# Altium project HomeAutomation.PrjPcb
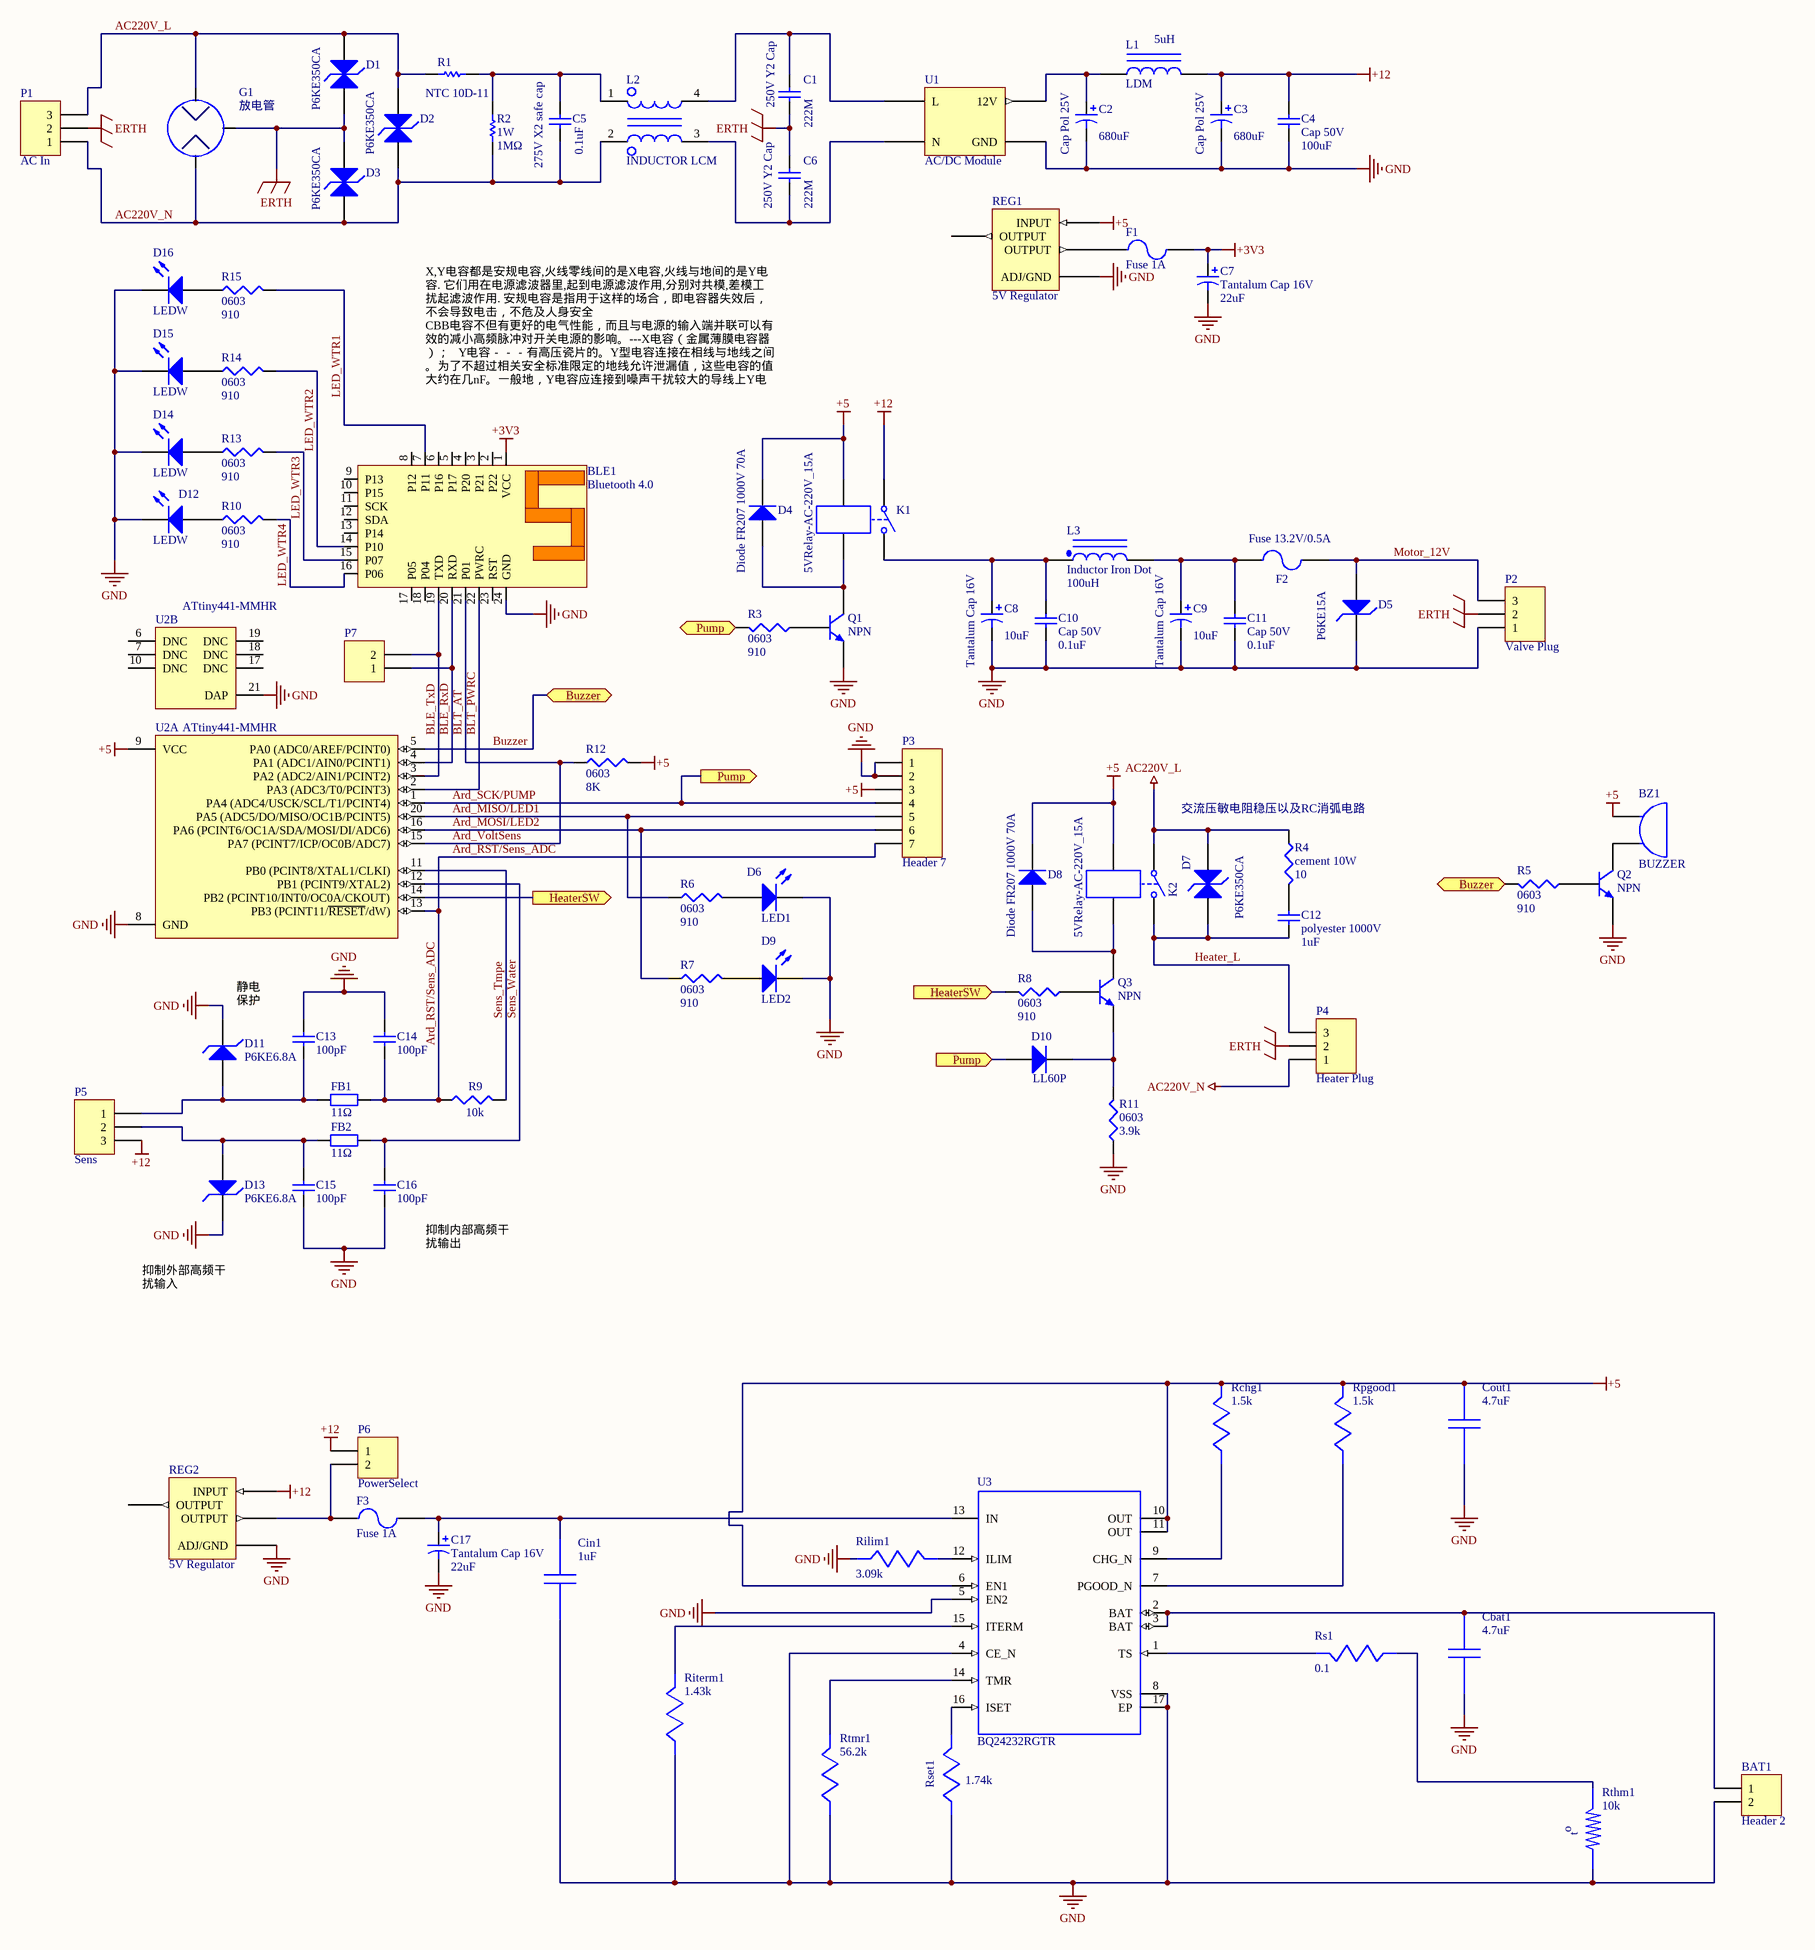
[diagram p0: Solar Water Heater Controller.SchDoc]
1 sheet, 88 parts. Net scope: flat (ports and power ports of the same name join across sheets).
Board file: Solar Water Heater Controller.PcbDoc

## Sheet Solar Water Heater Controller.SchDoc
size A2; PageSetup: Record=PageOptions|CenterHorizontal=True|CenterVertical=True|PrintScale=0.97|XCorrection=1.00|YCorrection=1.00|PrintKind=1|BorderSize=5000000|LeftOffset=0|BottomOffset=0|Orientation=2|PaperLength=1000|PaperWidth=1000|Scale=100|PaperSource=7|PrintQuality=-3|MediaType=1|DitherType=10|PrintScaleMode=1|PaperKind=A4 (210 x 297毫米)|PaperIndex=9

### Parts
BAT1  Header 2  [HDR1X2]
BLE1  Bluetooth 4.0  [JDY-08]
BZ1  BUZZER  [Buzzer]
C1  250V Y2 Cap  value 222M  [CapY2]
C2  Cap Pol 25V  value 680uF  [Cap680uf]
C3  Cap Pol 25V  value 680uF  [Cap680uf]
C4  Cap 50V  value 100uF  [1608[0603]]
C5  275V X2 safe cap  value 0.1uF  [CapX2]
C6  250V Y2 Cap  value 222M  [CapY2]
C7  Tantalum Cap 16V  value 22uF  [CAPC3216X175N]
C8  Tantalum Cap 16V  value 10uF  [CAPC3216X175N]
C9  Tantalum Cap 16V  value 10uF  [CAPC3216X175N]
C10  Cap 50V  value 0.1uF  [1608[0603]]
C11  Cap 50V  value 0.1uF  [1608[0603]]
C12  polyester 1000V  value 1uF  [CBB21 Capacitor]
C13  value 100pF  [1608[0603]]  (hidden comment: Cap Semi)
C14  value 100pF  [1608[0603]]  (hidden comment: Cap Semi)
C15  value 100pF  [1608[0603]]  (hidden comment: Cap Semi)
C16  value 100pF  [1608[0603]]  (hidden comment: Cap Semi)
C17  Tantalum Cap 16V  value 22uF  [CAPC3216X175N]
Cbat1  value 4.7uF  [1608[0603]]  (hidden comment: GRM219C81A475KE34D)
Cin1  value 1uF  [1608[0603]]  (hidden comment: GRM188R61A105KA61D)
Cout1  value 4.7uF  [1608[0603]]  (hidden comment: GRM21BR61E475MA12L)
D1  P6KE350CA  [DO-15]
D2  P6KE350CA  [DO-15]
D3  P6KE350CA  [DO-15]
D4  Diode FR207 1000V 70A  [DO-15]
D5  P6KE15A  [DO-15]
D6  LED1  [LED_1420]
D7  P6KE350CA  [DO-15]
D8  Diode FR207 1000V 70A  [DO-15]
D9  LED2  [LED_1420]
D10  LL60P  [LL60P]
D11  P6KE6.8A  [ONSC-SMB-2-403A-03_H_V]
D12  LEDW  [LED_1420]
D13  P6KE6.8A  [ONSC-SMB-2-403A-03_H_V]
D14  LEDW  [LED_1420]
D15  LEDW  [LED_1420]
D16  LEDW  [LED_1420]
F1  Fuse 1A  [6-0805_L]
F2  Fuse 13.2V/0.5A  [CAPC3216X100N]
F3  Fuse 1A  [6-0805_L]
FB1  value 11Ω  [6-0805_L]  (hidden comment: FB)
FB2  value 11Ω  [6-0805_L]  (hidden comment: FB)
G1  放电管  [GAS TUBE]
K1  5VRelay-AC-220V_15A  [SZ-S105LM]
K2  5VRelay-AC-220V_15A  [SZ-S105LM]
L1  LDM  value 5uH  [CD54]
L2  INDUCTOR LCM  [sumida CPFC1709/MS]
L3  Inductor Iron Dot  value 100uH  [CD54]
P1  AC In  [3P 5.08mm Connecter]
P2  Valve Plug  [3P 5.08mm Connecter]
P3  Header 7  [HDR1X7]
P4  Heater Plug  [3P 5.08mm Connecter]
P5  Sens  [3P 5.08mm Connecter]
P6  PowerSelect  [J1-0603]
P7  Serial  [HDR1X2]  (value not drawn)
Q1  NPN  [SOT23-3]
Q2  NPN  [SOT23-3]
Q3  NPN  [SOT23-3]
R1  NTC 10D-11  [NTC 10D-11]
R2  1W  value 1MΩ  [AXIAL-0.5]
R3  0603  value 910  [J1-0603]
R4  cement 10W  value 10  [5W Resistor]
R5  0603  value 910  [J1-0603]
R6  0603  value 910  [J1-0603]
R7  0603  value 910  [J1-0603]
R8  0603  value 910  [J1-0603]
R9  value 10k  [J1-0603]  (hidden comment: 0603)
R10  0603  value 910  [J1-0603]
R11  0603  value 3.9k  [J1-0603]
R12  0603  value 8K  [J1-0603]
R13  0603  value 910  [J1-0603]
R14  0603  value 910  [J1-0603]
R15  0603  value 910  [J1-0603]
Rchg1  value 1.5k  [J1-0603]  (hidden comment: CRCW04021K50FKED)
REG1  5V Regulator  [SOT223]
REG2  5V Regulator  [SOT223]
Rilim1  value 3.09k  [J1-0603]  (hidden comment: CRCW04023K09FKED)
Riterm1  value 1.43k  [J1-0603]  (hidden comment: CRCW04021K43FKED)
Rpgood1  value 1.5k  [J1-0603]  (hidden comment: CRCW04021K50FKED)
Rs1  value 0.1  [J1-0603]  (hidden comment: ERJ-2BSFR10X)
Rset1  value 1.74k  [J1-0603]  (hidden comment: CRCW04021K74FKED)
Rthm1  value 10k  [J1-0603]  (hidden comment: NCP15XH103E03RC)
Rtmr1  value 56.2k  [J1-0603]  (hidden comment: CRCW040256K2FKED)
U1  AC/DC Module  [HB12N10-2836]
U2  ATtiny441-MMHR  [20M2_N]  (parts A,B of 2)
U3  BQ24232RGTR  [RGT16-1700X1700TP]

### Ports
Buzzer (bidir), HeaterSW (in), HeaterSW (out), Pump, Pump (in), Pump (out)

### Nets
+3V3: BLE1.1(VCC) C7.1 F1.2
+5: BZ1.1(A) Cout1.1 D4.2(K) D8.2(K) K1.3 K2.3 P3.3 R12.2 Rchg1.1 REG1.3(INPUT) Rpgood1.1 U2.9(VCC) U3.6(EN1) U3.10(OUT) U3.11(OUT)
+12: C3.1 C4.2 K1.1 L1.2 P5.3 P6.1 REG2.3(INPUT)
AC220V_L: D1.2(K) D2.2(K) D7.2(K) G1.1 K2.1 P1.3 R1.2 R4.1
AC220V_N: C5.2 D2.1(A) D3.1(A) G1.3 L2.2 P1.1 P4.1 R2.1
ERTH: C1.1 C6.2 D1.1(A) D3.2(K) G1.2 P1.2 P2.2 P4.2
GND: BAT1.2 BLE1.24(GND) C2.2 C3.2 C4.1 C7.2 C8.2 C9.2 C10.1 C11.1 C13.2 C14.2 C15.2 C16.2 C17.2 Cbat1.2 Cin1.2 Cout1.2 D5.2(K) D6.2(K) D9.2(K) D11.2(K) D12.2(K) D13.2(K) D14.2(K) D15.2(K) D16.2(K) P2.1 P3.1 P3.2 Q1.3(E) Q2.3(E) R11.1 REG1.1(ADJ/GND) REG2.1(ADJ/GND) Rilim1.2 Riterm1.2 Rset1.2 Rthm1.1 Rtmr1.2 U1.5(GND) U2.8(GND) U2.21(DAP) U3.4(CE_N) U3.5(EN2) U3.8(VSS) U3.17(EP)
Ard_MISO/LED1: P3.5 R6.1 U2.20(PA5_(ADC5/DO/MISO/OC1B/PCINT5))
Ard_MOSI/LED2: P3.6 R7.1 U2.16(PA6_(PCINT6/OC1A/SDA/MOSI/DI/ADC6))
Ard_RST/Sens_ADC: C14.1 FB1.2 P3.7 R9.2 U2.13(PB3_(PCINT11/~{RESET}/dW))
Ard_SCK/PUMP: D10.1(A) P3.4 R3.2 U2.1(PA4_(ADC4/USCK/SCL/T1/PCINT4)) ; port Pump
Ard_VoltSens: BLE1.21(P01) R12.1 U2.15(PA7_(PCINT7/ICP/OC0B/ADC7))  [also labelled BLT_AT]
BLE_RxD: BLE1.20(RXD) P7.1 U2.4(PA1_(ADC1/AIN0/PCINT1))
BLE_TxD: BLE1.19(TXD) P7.2 U2.3(PA2_(ADC2/AIN1/PCINT2))
BLT_PWRC: BLE1.22(PWRC) U2.2(PA3_(ADC3/T0/PCINT3))
Buzzer: R5.2 U2.5(PA0_(ADC0/AREF/PCINT0)) ; port Buzzer
Heater_L: C12.2 D7.1(A) K2.2 P4.3
LED_WTR1: BLE1.7(P11) R15.1
LED_WTR2: BLE1.14(P10) R14.1
LED_WTR3: BLE1.15(P07) R13.1
LED_WTR4: BLE1.16(P06) R10.1
Motor_12V: D5.1(A) F2.1 P2.3
Sens_Tmpe: R9.1 U2.11(PB0_(PCINT8/XTAL1/CLKI))
Sens_Water: C16.1 FB2.2 U2.12(PB1_(PCINT9/XTAL2))
NetBAT1_1: BAT1.1 Cbat1.1 U3.2(BAT) U3.3(BAT)
NetBZ1_2: BZ1.2(B) Q2.1(C)
NetC1_2: C1.2 L2.4 U1.1(L)
NetC2_1: C2.1 L1.1 U1.3(12V)
NetC5_1: C5.1 L2.1 R1.1 R2.2
NetC6_1: C6.1 L2.3 U1.2(N)
NetC8_1: C8.1 C10.2 K1.2 L3.1
NetC9_1: C9.1 C11.2 F2.2 L3.2
NetC12_1: C12.1 R4.2
NetC13_1: C13.1 D11.1(A) FB1.1 P5.1
NetC15_1: C15.1 D13.1(A) FB2.1 P5.2
NetC17_1: C17.1 Cin1.1 F3.2 U3.13(IN)
NetD4_1: D4.1(A) K1.4 Q1.1(C)
NetD6_1: D6.1(A) R6.2
NetD8_1: D8.1(A) K2.4 Q3.1(C)
NetD9_1: D9.1(A) R7.2
NetD10_2: D10.2(K) Q3.3(E) R11.2
NetD12_1: D12.1(A) R10.2
NetD14_1: D14.1(A) R13.2
NetD15_1: D15.1(A) R14.2
NetD16_1: D16.1(A) R15.2
NetF1_1: F1.1 REG1.2(OUTPUT)
NetF3_1: F3.1 P6.2 REG2.2(OUTPUT)
NetQ1_2: Q1.2(B) R3.1
NetQ2_2: Q2.2(B) R5.1
NetQ3_2: Q3.2(B) R8.1
NetR8_2: R8.2 U2.14(PB2_(PCINT10/INT0/OC0A/CKOUT)) ; port HeaterSW
NetRchg1_2: Rchg1.2 U3.9(CHG_N)
NetRilim1_1: Rilim1.1 U3.12(ILIM)
NetRiterm1_1: Riterm1.1 U3.15(ITERM)
NetRpgood1_2: Rpgood1.2 U3.7(PGOOD_N)
NetRs1_1: Rs1.1 U3.1(TS)
NetRs1_2: Rs1.2 Rthm1.2
NetRset1_1: Rset1.1 U3.16(ISET)
NetRtmr1_1: Rtmr1.1 U3.14(TMR)

Not connected (* = marked no-connect by the designer): BLE1 2(P22) 3(P21) 4(P20) 5(P17) 6(P16) 8(P12) 9(P13) 10(P15) 11(SCK) 12(SDA) 13(P14) 17(P05) 18(P04) 23(RST); REG1 4(OUTPUT); REG2 4(OUTPUT); U2 6(DNC) 7(DNC) 10(DNC) 17(DNC) 18(DNC) 19(DNC)

### Notes on the sheet
- X,Y电容都是安规电容,火线零线间的是X电容,火线与地间的是Y电容. 它们用在电源滤波器里,起到电源滤波作用,分别对共模,差模工扰起滤波作用. 安规电容是指用于这样的场合，即电容器失效后，不会导致电击，不危及人身安全
  CBB电容不但有更好的电气性能，而且与电源的输入端并联可以有效的减小高频脉冲对开关电源的影响。---X电容（金属薄膜电容器）；   Y电容－－－有高压瓷片的。Y型电容连接在相线与地线之间。为了不超过相关安全标准限定的地线允许泄漏值，这些电容的值大约在几nF。一般地，Y电容应连接到噪声干扰较大的导线上Y电容分为Y1电容和Y2电容，Y1属于双绝缘Y电容,用于跨接一二次侧.Y2则属于基本单绝缘Y电容,用于跨接一次侧对保护大地即FG线根据IEC 60384-14，电容器分为X电容及Y电容， 1. X电容是指跨于L-N之间的电容器， 2. Y电容是指跨于L-G/N-G之间的电容器。 (L="Line", N="Neutral", G="Ground")
- (near R4) 交流压敏电阻稳压以及RC消弧电路
- 静电
  保护
- 抑制外部高频干扰输入
- (near C16) 抑制内部高频干扰输出
- (near Rthm1) o
- (near Rthm1) t

### Library data of the parts
BAT1 P6 P7 = Header 2: Header, 2-Pin; LatestRevisionDate: 17-Jul-2002; LatestRevisionNote: Re-released for DXP Platform.; Publisher: Altium Limited
BLE1 = CC2541-Small
BZ1 = BUZZER: 5V有源蜂鸣器 电磁式 SOT塑封管 5V 12mm
C1 C6 = Cap Semi: JNC222M 250V; Published: 8-Jun-2000; LatestRevisionDate: 29-May-2009; LatestRevisionNote: IPC-7351 Footprint Added.; PackageReference: C1206; Publisher: Altium Limited; PackageDescription: Chip Capacitor
C2 C3 = Cap Pol1: Polarized Capacitor (Radial); Published: 8-Jun-2000; LatestRevisionDate: 17-Jul-2002; LatestRevisionNote: Re-released for DXP Platform.; PackageReference: RB7.6-15; Publisher: Altium Limited; PackageDescription: Polarized Capacitor (Radial); 2 Leads
C4 C10-C16 = Cap Semi: Capacitor (Semiconductor SIM Model); Published: 8-Jun-2000; LatestRevisionDate: 29-May-2009; LatestRevisionNote: IPC-7351 Footprint Added.; PackageReference: C1206; Publisher: Altium Limited; PackageDescription: Chip Capacitor
C5 = Cap Semi: MPX104KV 275V X2安规电容; Published: 8-Jun-2000; LatestRevisionDate: 29-May-2009; LatestRevisionNote: IPC-7351 Footprint Added.; PackageReference: C1206; Publisher: Altium Limited; PackageDescription: Chip Capacitor
C7 C17 = Cap Pol3: 22UF 16V 226K A3216 1206; Published: 8-Jun-2000; LatestRevisionDate: 29-May-2009; LatestRevisionNote: IPC-7351 Footprint Added.; PackageReference: C0805; Publisher: Altium Limited; PackageDescription: Chip Capacitor
C8 C9 = Cap Pol3: Published: 8-Jun-2000; LatestRevisionDate: 29-May-2009; LatestRevisionNote: IPC-7351 Footprint Added.; PackageReference: C0805; Publisher: Altium Limited; PackageDescription: Chip Capacitor
Cbat1 = GRM219C81A475KE34D: GRM219C81A475KE3; Manufacturer Name: MuRata; PackageReference: GRM219C81A475KE34D; Manufacturer Part Number: GRM219C81A475KE34D
Cin1 = GRM188R61A105KA61D: GRM188R61A105KA6; Manufacturer Name: MuRata; PackageReference: GRM188R61A105KA61D; Manufacturer Part Number: GRM188R61A105KA61D
Cout1 = GRM21BR61E475MA12L: GRM21BR61E475MA1; Manufacturer Name: MuRata; PackageReference: GRM21BR61E475MA12L; Manufacturer Part Number: GRM21BR61E475MA12L
D1-D3 D7 = Diode TVS
D4 D8 = Diode 1N914: High Conductance Fast Diode; Published: 8-Jun-2000; LatestRevisionDate: 17-Jul-2002; LatestRevisionNote: Re-released for DXP Platform.; DatasheetVersion: 1997; PackageReference: DO-35; Publisher: Altium Limited; PackageDescription: Diode, Axial; Body 3.8 x 1.9 mm (LxDia. max), Lead Dia. 0.53 mm (max); Code_JEDEC: DO-204-AH; ComponentLink1Description: Manufacturer Link; ComponentLink1URL: http://www.fairchildsemi.com/; ComponentLink2Description: Datasheet; ComponentLink2URL: http://www.fairchildsemi.com/ds/1N%2F1N4448.pdf
D5 D11 = Diode TVS_S
D6 D9 D12 D14-D16 = LED2: Typical RED, GREEN, YELLOW, AMBER GaAs LED; Published: 8-Jun-2000; LatestRevisionDate: 17-Jul-2002; LatestRevisionNote: Re-released for DXP Platform.; PackageVersion: Feb-2002; PackageReference: 3.2X1.6X1.1; Publisher: Altium Limited; PackageDescription: SM LED; 2 Flat Leads
D10 = Diode 1N914: Published: 8-Jun-2000; LatestRevisionDate: 17-Jul-2002; LatestRevisionNote: Re-released for DXP Platform.; DatasheetVersion: 1997; PackageReference: DO-35; Publisher: Altium Limited; PackageDescription: Diode, Axial; Body 3.8 x 1.9 mm (LxDia. max), Lead Dia. 0.53 mm (max); Code_JEDEC: DO-204-AH; ComponentLink1Description: Manufacturer Link; ComponentLink1URL: http://www.fairchildsemi.com/; ComponentLink2Description: Datasheet; ComponentLink2URL: http://www.fairchildsemi.com/ds/1N%2F1N4448.pdf
D13 = Diode TVS_S: P6KE6.8A SMB
F1 F3 = Fuse 2: Fuse 1000mA 6V; Published: 8-Jun-2000; LatestRevisionDate: 17-Jul-2002; LatestRevisionNote: Re-released for DXP Platform.; PackageReference: PIN-W2/E2.8; Publisher: Altium Limited; PackageDescription: Thru-Hole; 2 Leads
F2 = Fuse 2: 1206SMD 500mA 13.2V/0.5A; Published: 8-Jun-2000; LatestRevisionDate: 17-Jul-2002; LatestRevisionNote: Re-released for DXP Platform.; PackageReference: PIN-W2/E2.8; Publisher: Altium Limited; PackageDescription: Thru-Hole; 2 Leads
FB1 FB2 = Res2: 磁珠; Published: 8-Jun-2000; LatestRevisionDate: 17-Jul-2002; LatestRevisionNote: Re-released for DXP Platform.; PackageReference: AXIAL-0.4; Publisher: Altium Limited; PackageDescription: Axial Device, Thru-Hole; 2 Leads; 0.4 in Pin Spacing
G1 = GOT: 3RM230L-8 230V
K1 K2 = Relay-SPST: Single-Pole Single-Throw Relay SZ-S-105LM; Published: 24-Mar-1999; LatestRevisionDate: 17-Jul-2002; LatestRevisionNote: Re-released for DXP Platform.; PackageReference: MODULE4; Publisher: Altium Limited
L1 = INDUCTOR IRON: 4R7H 贴片电感
L3 = Inductor Iron Dot: 贴片 CD54 100uH; Published: 24-Mar-1999; LatestRevisionDate: 17-Jul-2002; LatestRevisionNote: Re-released for DXP Platform.; PackageReference: DIODE_SMC; Publisher: Altium Limited; PackageDescription: Diode; 2 Leads
P1 P2 P4 P5 = Header 3: Header, 3-Pin; LatestRevisionDate: 17-Jul-2002; LatestRevisionNote: Re-released for DXP Platform.; Publisher: Altium Limited
P3 = Header 7: Header, 7-Pin; LatestRevisionDate: 17-Jul-2002; LatestRevisionNote: Re-released for DXP Platform.; Publisher: Altium Limited
Q1-Q3 = NPN: NPN Bipolar Transistor; Published: 8-Jun-2000; LatestRevisionDate: 17-Jul-2002; LatestRevisionNote: Re-released for DXP Platform.; PackageReference: TO-226-AA; Publisher: Altium Limited; PackageDescription: TO, Flat Index; 3 In-Line, Axial Leads; Body Dia. 4.8mm; Leads 0.55 x 0.51 mm (max); Code_JEDEC: TO-226-AA
R1 R2 = Res Semi: Semiconductor Resistor; Published: 8-Jun-2000; LatestRevisionDate: 17-Jul-2002; LatestRevisionNote: Re-released for DXP Platform.; PackageReference: AXIAL-0.5; Publisher: Altium Limited; PackageDescription: Axial Device, Thru-Hole; 2 Leads; 0.5 in Pin Spacing
  R1: Value: 10D-11
R3-R15 = Res3: Resistor; Published: 8-Jun-2000; LatestRevisionDate: 29-May-2009; LatestRevisionNote: IPC-7351 Footprint Added.; PackageReference: J1-0603; Publisher: Altium Limited; PackageDescription: Chip Resistor
Rchg1 Rpgood1 = CRCW04021K50FKED: Manufacturer Name: Vishay-Dale; PackageReference: CRCW04021K50FKED; Manufacturer Part Number: CRCW04021K50FKED
REG1 REG2 = AMS1117
Rilim1 = CRCW04023K09FKED: Manufacturer Name: Vishay-Dale; PackageReference: CRCW04023K09FKED; Manufacturer Part Number: CRCW04023K09FKED
Riterm1 = CRCW04021K43FKED: Manufacturer Name: Vishay-Dale; PackageReference: CRCW04021K43FKED; Manufacturer Part Number: CRCW04021K43FKED
Rs1 = ERJ-2BSFR10X: Manufacturer Name: Panasonic; PackageReference: ERJ-2BSFR10X; Manufacturer Part Number: ERJ-2BSFR10X
Rset1 = CRCW04021K74FKED: Manufacturer Name: Vishay-Dale; PackageReference: CRCW04021K74FKED; Manufacturer Part Number: CRCW04021K74FKED
Rthm1 = NCP15XH103E03RC: Manufacturer Name: MuRata; PackageReference: NCP15XH103E03RC; Manufacturer Part Number: NCP15XH103E03RC
Rtmr1 = CRCW040256K2FKED: Manufacturer Name: Vishay-Dale; PackageReference: CRCW040256K2FKED; Manufacturer Part Number: CRCW040256K2FKED
U1 = AC/DC Moule: AC/DC Module 220V AC / 12V DC 1A
U2 = ATtiny44A-MMHR: 8-bit AVR Microcontroller,  20MHz, 1.8-5.5V, 4KB Flash, 256 Bytes EEPROM, 256 Bytes SRAM, 20-pin VQFN, Industrial Grade (-40癈 to 85癈), Pb-Free, Reel; DatasheetVersion: revD, Apr-2011; PackageVersion: revB, Oct-2008; PackageReference: 20M2; PackageDescription: 20-pad, 3x3x0.85mm Body, Pitch 0.45mm, 1.55x1.55mm Exposed Pad, Plastic Very Thin QFN Package (VQFN); ComponentLink1Description: Manufacturer URL; ComponentLink1URL: http://www.atmel.com/; ComponentLink2Description: ATtiny24A/44A/84A Datasheet; ComponentLink2URL: http://www.atmel.com/dyn/resources/prod_documents/doc8183.pdf; ComponentLink3Description: ATtiny24A/44A/84A Summary; ComponentLink3URL: http://www.atmel.com/dyn/resources/prod_documents/8183S.pdf
U3 = BQ24232RGTR: Manufacturer Name: Texas Instruments; PackageReference: BQ24232RGTR; Manufacturer Part Number: BQ24232RGTR; Value: N/A